# EAGLE design electrodo (EAGLE 9.6.2)
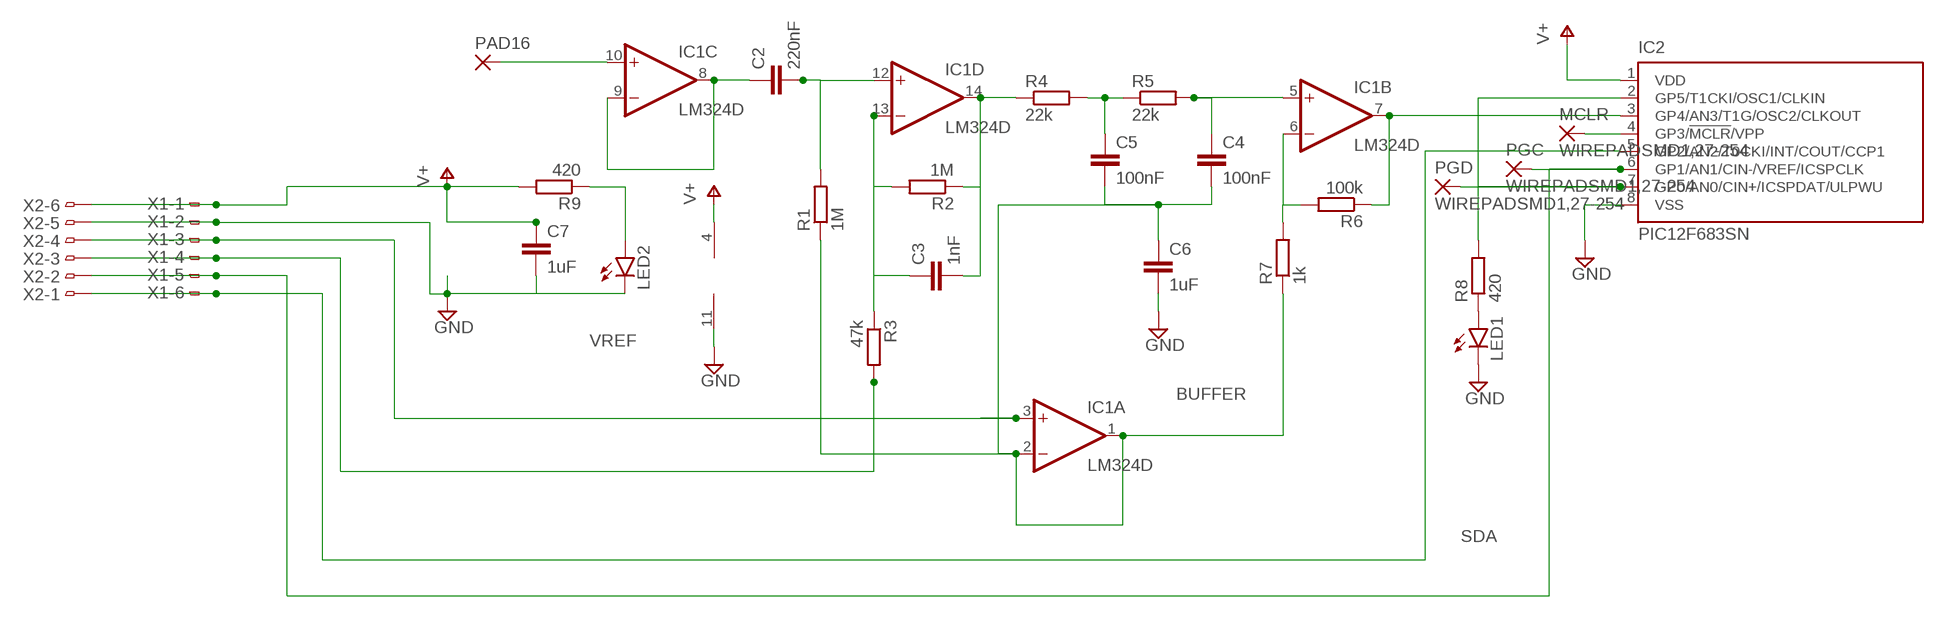
[diagram p0: schematic, sheet 1]

## Parts
C2  220nF  C-EUC0603  [C0603]
C3  1nF  C-EUC0603  [C0603]
C4  100nF  C-EUC0603  [C0603]
C5  100nF  C-EUC0603  [C0603]
C6  1uF  C-EUC0603  [C0603]
C7  1uF  C-EUC0603  [C0603]
IC1  LM324D  [SO14]
IC2  PIC12F683SN  [SO-08]
LED1  LEDSML0805  [SML0805]
LED2  LEDSML0805  [SML0805]
MCLR  WIREPADSMD1,27-254  [SMD1,27-2,54]
PAD16  1,6/0,9  [1,6/0,9]
PGC  WIREPADSMD1,27-254  [SMD1,27-2,54]
PGD  WIREPADSMD1,27-254  [SMD1,27-2,54]
R1  1M  R-EU_R0603  [R0603]
R2  1M  R-EU_R0603  [R0603]
R3  47k  R-EU_R0603  [R0603]
R4  22k  R-EU_R0603  [R0603]
R5  22k  R-EU_R0603  [R0603]
R6  100k  R-EU_R0603  [R0603]
R7  1k  R-EU_R0603  [R0603]
R8  420  R-EU_R0603  [R0603]
R9  420  R-EU_R0603  [R0603]
X1  FH12-08S-1SH  [FH12-08S-1SH]
X2  FH12-08S-1SH  [FH12-08S-1SH]

## Nets
BUFFER: C4.2 C5.2 C6.1 IC1.1(A:OUT) IC1.2(A:-IN) R1.1 R7.1
GND: C6.2 C7.2 IC1.11(P:V-) IC2.8(VSS) LED1.C LED2.C X1.2 X2.5
N$1: IC2.2(GP5/T1CKI/OSC1/CLKIN) R8.2
N$2: C4.1 IC1.5(B:+IN) R5.2
N$3: C2.2 IC1.12(D:+IN) R1.2
N$4: IC1.7(B:OUT) IC2.3(GP4/AN3/T1G/OSC2/CLKOUT) R6.1
N$5: LED1.A R8.1
N$6: C3.2 IC1.14(D:OUT) R2.1 R4.1
N$7: LED2.A R9.1
N$8: IC2.4(GP3/!MCLR!/VPP) MCLR.1(P)
N$9: C5.1 R4.2 R5.1
N$10: IC1.6(B:-IN) R6.2 R7.2
N$11: IC1.10(C:+IN) PAD16.1(P)
N$13: C2.1 IC1.8(C:OUT) IC1.9(C:-IN)
N$14: C3.1 IC1.13(D:-IN) R2.2 R3.1
N$15: IC2.7(GP0/AN0/CIN+/ICSPDAT/ULPWU) PGD.1(P)
REFGROUND: R3.2 X1.4 X2.3
SCL: IC2.6(GP1/AN1/CIN-/VREF/ICSPCLK) PGC.1(P) X1.5 X2.2
SDA: IC2.5(GP2/AN2/T0CKI/INT/COUT/CCP1) X1.6 X2.1
V+: C7.1 IC1.4(P:V+) IC2.1(VDD) R9.2 X1.1 X2.6
VREF: IC1.3(A:+IN) X1.3 X2.4

## Library data of the parts
C2-C7 = rcl:C-EU: CAPACITOR, European symbol; SPICEPREFIX: C
IC1 = linear:LM324: OP AMP
IC2 = microchip:PIC12F683: 8-Pin Flash-Based, 8-Bit CMOS Microcontrollers with nanoWatt Technology Source: http://ww1.microchip.com/downloads/en/DeviceDoc/41211D_.pdf; MF: MICROCHIP; MPN: PIC12F683-I/SN; OC_FARNELL: 9759042; OC_NEWARK: 61K3434
LED1 LED2 = led:LED: LED OSRAM: - CHIPLED LG R971, LG N971, LY N971, LG Q971, LY Q971, LO R971, LY R971 LH N974, LH R974 LS Q976, LO Q976, LY Q976 LO Q996 - Hyper CHIPLED LW Q18S LB Q993, LB Q99A, LB R99A - SideLED LS A670, LO A670, LY A670, LG A670, LP A670 LB A673, LV A673, LT A673, LW A673 LH A674 LY A675 LS A676, LA A676, LO A676, LY A676, LW A676 LS A679, LY A679, LG A679 - Hyper Micro SIDELED® LS Y876, LA Y876, LO Y876, LY Y876 LT Y87S - SmartLED LW L88C, LW L88S LB L89C, LB L89S, LG L890 LS L89K, LO L89K, LY L89K LS L896, LA L896, LO L896, LY L896 - TOPLED LS T670, LO T670, LY T670, LG T670, LP T670 LSG T670, LSP T670, LSY T670, LOP T670, LYG T670 LG T671, LOG T671, LSG T671 LB T673, LV T673, LT T673, LW T673 LH T674 LS T676, LA T676, LO T676, LY T676, LB T676, LH T676, LSB T676, LW T676 LB T67C, LV T67C, LT T67C, LS T67K, LO T67K, LY T67K, LW E67C LS E67B, LA E67B, LO E67B, LY E67B, LB E67C, LV E67C, LT E67C LW T67C LS T679, LY T679, LG T679 LS T770, LO T770, LY T770, LG T770, LP T770 LB T773, LV T773, LT T773, LW T773 LH T774 LS E675, LA E675, LY E675, LS T675 LS T776, LA T776, LO T776, LY T776, LB T776 LHGB T686 LT T68C, LB T68C - Hyper Mini TOPLED® LB M676 - Mini TOPLED Santana® LG M470 LS M47K, LO M47K, LY M47K Source: http://www.osram.convergy.de LUXEON: - LUMILED® LXK2-PW12-R00, LXK2-PW12-S00, LXK2-PW14-U00, LXK2-PW14-V00 LXK2-PM12-R00, LXK2-PM12-S00, LXK2-PM14-U00 LXK2-PE12-Q00, LXK2-PE12-R00, LXK2-PE12-S00, LXK2-PE14-T00, LXK2-PE14-U00 LXK2-PB12-K00, LXK2-PB12-L00, LXK2-PB12-M00, LXK2-PB14-N00, LXK2-PB14-P00, LXK2-PB14-Q00 LXK2-PR12-L00, LXK2-PR12-M00, LXK2-PR14-Q00, LXK2-PR14-R00 LXK2-PD12-Q00, LXK2-PD12-R00, LXK2-PD12-S00 LXK2-PH12-R00, LXK2-PH12-S00 LXK2-PL12-P00, LXK2-PL12-Q00, LXK2-PL12-R00 Source: www.luxeon.com KINGBRIGHT: KA-3528ASYC Source: www.kingbright.com
MCLR PGC PGD = wirepad:WIREPAD: Wire PAD connect wire on PCB
PAD16 = wirepad:1,6/0,9: THROUGH-HOLE PAD
R1-R9 = rcl:R-EU_: RESISTOR, European symbol; SPICEPREFIX: R
X1 X2 = JST-PH-6-1mm:FH12-08S-1S: 1mm Pitch Connectors For FPC/FFC Source: Data sheet <http://www.hirose.co.jp/cataloge_hp/e58605370.pdf>; OC_FARNELL: unknown; OC_NEWARK: unknown

## Board
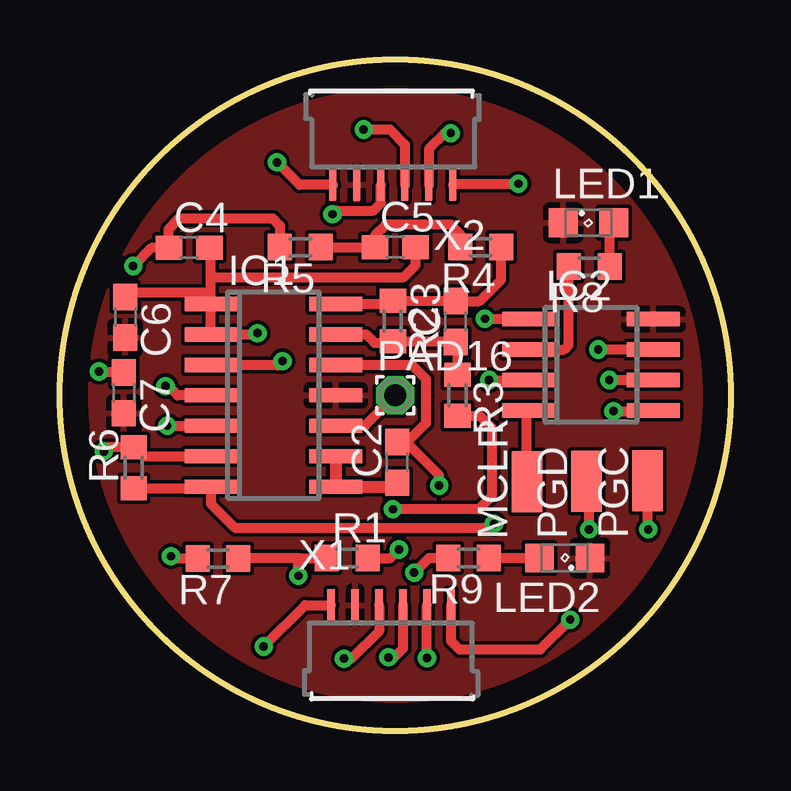
[diagram p1: board, top side]
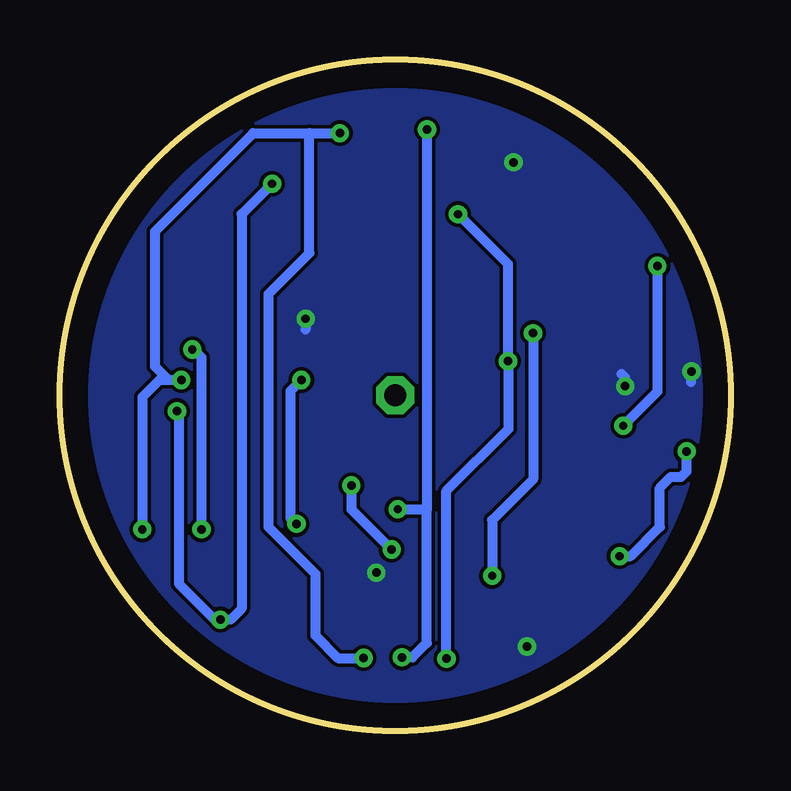
[diagram p2: board, bottom side, seen from below]

Size 27.94 x 27.94 mm. Coordinates in mm from the lower left corner, seen from the top.
Outline: circle at 13.97,13.97 radius 13.97
Copper layers (1*16): Top 0.035mm / dielectric 0.15mm / Bottom 0.035mm
Design rules "default *": minimum track width 6mil, minimum drill 0.35mm, track to track 6mil, track to pad 6mil, pad to pad 6mil, via to via 6mil, smd to smd 6mil, copper to edge 40mil, drill to drill 6mil, minimum pad ring 10mil, minimum via ring 8mil, stop-mask expansion 4mil, vias tented up to drill 0mil, thermal gap 10mil

### Footprints (pad centres in the part's own frame; a part is rotated, then mirrored left to right if it is on the bottom)
C0603 = smd 1.1 x 1: 1 -0.85,0; 2 0.85,0
SO14 = smd 0.6 x 2.2: 1 -3.81,-2.6; 2 -2.54,-2.6; 3 -1.27,-2.6; 4 0,-2.6; 5 1.27,-2.6; 6 2.54,-2.6; 7 3.81,-2.6; 8 3.81,2.6; 9 2.54,2.6; 10 1.27,2.6; 11 0,2.6; 12 -1.27,2.6; 13 -2.54,2.6; 14 -3.81,2.6
SO-08 = smd 0.6 x 2.2: 1 -1.905,-2.6; 2 -0.635,-2.6; 3 0.635,-2.6; 4 1.905,-2.6; 5 1.905,2.6; 6 0.635,2.6; 7 -0.635,2.6; 8 -1.905,2.6
SML0805 = smd 1.2 x 1.2: A 1.05,0; C -1.05,0
SMD1,27-2,54 = smd 1.27 x 2.54: 1 0,0
1,6/0,9 = drill 0.914 pad 1.6 octagon: 1 0,0
R0603 = smd 1 x 1.1: 1 -0.85,0; 2 0.85,0
FH12-08S-1SH = smd 0.3 x 1.3: 1 -2.5,3.25; 2 -1.5,3.25; 3 -0.5,3.25; 4 0.5,3.25; 5 1.5,3.25; 6 2.5,3.25

### Placement (x,y rotation side)
C2  14.05,11.18 90 top
C3  16.48,17.04 90 top
C4  5.38,20.12 0 top
C5  13.97,20.14 0 top
C6  2.72,17.22 270 top
C7  2.67,14.07 270 top
IC1  8.89,13.97 270 top
IC2  22.12,15.24 270 top
LED1  22.02,21.16 0 top
LED2  21.03,7.19 180 top
MCLR  19.46,10.36 0 top
PAD16  13.97,13.97 0 top
PGC  24.49,10.41 0 top
PGD  21.95,10.39 0 top
R1  11.96,7.19 0 top
R2  13.87,17.07 270 top
R3  16.56,13.97 270 top
R4  17.53,20.14 180 top
R5  10.01,20.14 180 top
R6  3.07,10.95 90 top
R7  6.58,7.16 180 top
R8  22.05,19.33 180 top
R9  17.02,7.19 180 top
X1  13.79,1.98 0 top
X2  13.87,25.98 180 top

### Tracks (layer width: path | path; a pad name or v marks a point on that pad's centre or on a via)
BUFFER  (via drill 0.35)
  Top 0.406: IC1.1 6.29,17.96 6.01,18.24 2.88,18.24 C6.1 | IC1.1 IC1.2 8.18,16.51 v8.23,16.56 | IC1.1 6.29,18.9 | 6.29,18.9 6.29,20.06 C4.2 | 6.29,18.9 14.33,18.9 14.82,19.39 C5.2 | 9.96,7.19 9.02,7.19 7.46,7.19 R7.1 | 9.96,7.19 R1.1 | v9.93,6.45 9.93,7.16 9.96,7.19
  Bottom 0.406: v8.23,16.56 8.23,10.46 9.93,8.76 v9.93,6.45
GND
  pour Top: 16.76,27.64 16.08,27.74 arc117 0.74,9.55 arc240 16.87,27.64
N$1
  Top 0.406: IC2.2 21.01,15.88 21.2,16.06 R8.2
N$2  (via drill 0.35)
  Top 0.406: R5.2 9.16,21.04 8.87,21.34 4.95,21.34 4.54,20.92 C4.1 3.81,20.12 v3.05,19.36 | v4.47,12.7 IC1.5
  Bottom 0.406: v3.05,19.36 3.05,14.12 v4.47,12.7
N$3  (via drill 0.35)
  Top 0.406: IC1.12 14.66,15.24 15.24,14.66 15.24,12.8 14.46,12.03 C2.2 14.42,12.03 15.8,10.64 v15.8,10.21 | R1.2 13.77,7.19 v14.12,7.54
  Bottom 0.406: v14.12,7.54 15.8,9.22 v15.8,10.21
N$4  (via drill 0.35)
  Top 0.406: v18.09,8.61 17.91,8.43 7.31,8.43 6.29,9.45 IC1.7 6.23,10.1 R6.1 | v17.88,14.6 IC2.3 | IC2.3
  Bottom 0.406: v18.09,8.61 18.34,8.87 18.34,14.15 v17.88,14.6
N$5
  Top 0.406: R8.1 22.9,20.98 LED1.A
N$6
  Top 0.406: IC1.14 13.73,17.78 R2.1 15.24,17.92 16.46,17.92 C3.2 17.49,17.89 18.38,18.78 R4.1
N$7
  Top 0.406: LED2.A R9.1
N$8
  Top 0.406: MCLR.1 19.46,13.27 IC2.4
N$9
  Top 0.406: R5.1 C5.1 13.12,20.64 13.56,21.08 16.28,21.08 16.68,20.69 R4.2
  Top 0.508: C5.1
N$10  (via drill 0.35)
  Top 0.406: IC1.6 3.44,11.43 R6.2 1.99,11.8 v1.83,11.63 | R7.2 4.72,7.16 v4.62,7.26
  Bottom 0.406: v4.62,7.26 4.17,7.26 2.95,8.48 2.95,10.11 2.49,10.57 2.06,10.57 1.83,10.8 v1.83,11.63
N$11
  Top 0.406: IC1.10 12.7,12.7 PAD16.1
N$13
  Top 0.508: IC1.9 IC1.8 13.88,10.16 C2.1
N$14
  Top 0.406: IC1.13 12.75,16.51 13.11,16.15 13.8,16.15 R2.2 16.46,16.22 C3.1 16.56,16.12 R3.1
N$15  (via drill 0.35)
  Top 0.406: IC2.7 v22.43,15.88 | v22.43,15.88 | v22.05,8.38 22.05,10.29 PGD.1
  Bottom 0.406: v22.43,15.88 22.38,15.88 22.05,15.55 v22.05,8.38
REFGROUND  (via drill 0.35)
  Top 0.406: R3.2 17.49,13.12 17.98,12.62 17.98,9.75 17.45,9.22 v13.87,9.22 | v13.69,3.05 13.92,3.05 14.3,3.43 14.3,5.22 X1.4 | v12.65,25.04 13.74,25.04 14.37,24.42 X2.3
  Bottom 0.406: v12.65,25.04 12.65,9.22 | v13.69,3.05 13.26,3.05 12.65,3.66 12.65,9.22 | v13.87,9.22 12.65,9.22
SCL  (via drill 0.35)
  Top 0.406: IC2.6 v22.89,14.6 v22.88,14.6 | v24.51,8.38 24.48,8.41 PGC.1 | v15.29,3.02 X1.5 | v16.28,24.89 16.03,24.89 15.37,24.23 X2.2
  Bottom 0.406: 17.55,24.89 17.55,19.89 19.25,18.19 19.25,8.48 17.3,6.53 17.3,3.96 16.36,3.02 v15.29,3.02 | v24.51,8.38 24.51,13.89 23.8,14.6 v22.88,14.6 23.42,14.6 23.98,15.16 23.98,20.8 19.89,24.89 17.55,24.89 | 17.55,24.89 v16.28,24.89
SDA  (via drill 0.35)
  Top 0.406: v23.06,13.31 24.7,13.31 IC2.5 | X1.6 16.29,3.72 16.64,3.38 20.02,3.38 v21.26,4.62 | X2.1 16.42,22.78 v19.1,22.78
  Bottom 0.406: v19.1,22.78 20.37,21.51 20.37,5.08 20.83,4.62 v21.26,4.62 21.49,4.62 22.99,6.12 22.99,13.23 v23.06,13.31
V+  (via drill 0.35)
  Top 0.406: IC1.4 4.9,13.97 4.52,14.35 v4.39,14.35 | IC2.1 17.72,17.14 v17.7,17.16 | R9.2 15.37,7.19 v14.76,6.58 | C7.1 1.66,14.92 v1.63,14.96 | v8.48,3.51 10.21,5.23 X1.1 | X2.6 9.98,22.73 v9.04,23.67
  Bottom 0.406: v4.39,14.35 4.39,14.71 4.55,14.86 | v17.7,17.16 17.7,16.71 | v1.63,14.96 1.65,14.94 1.65,14.53
  pour Bottom (rank 2): 14.48,27.89 13.54,27.86 arc75 0.53,17.35 arc281 14.58,27.89
VREF  (via drill 0.35)
  Top 0.406: IC1.3 6.31,15.21 9.09,15.21 v9.27,15.39 | v11.35,21.51 11.51,21.67 13.06,21.67 13.37,21.98 X2.4 | X1.3 13.29,4.15 12.15,3 v11.84,3
  Bottom 0.406: v11.35,21.51 9.27,19.43 v9.27,15.39 9.25,15.37 9.25,12.57 11.84,9.98 v11.84,3